# Altium schematic sheet design_16.SchDoc: design
size 414 x 279 mm; Date: 1/25/2021 11:39:22 PM; SheetNumber: 17; Origin: Eagle; GateName_1: G$1; SymbolName_1: A3-L-GUMSTIX; LibraryName: qualified_1; DeviceSetName: A3-L-GUMSTIX; A: A; B: B; C: C; D: D; E: E; F: F; G: G; H: H; 1: 1; 2: 2; 3: 3; 4: 4; 5: 5; Sheet: Sheet:; C:/Gumstix/gumstix-logo-16.bmp: C:/Gumstix/gumstix-logo-16.bmp; Board: Board:
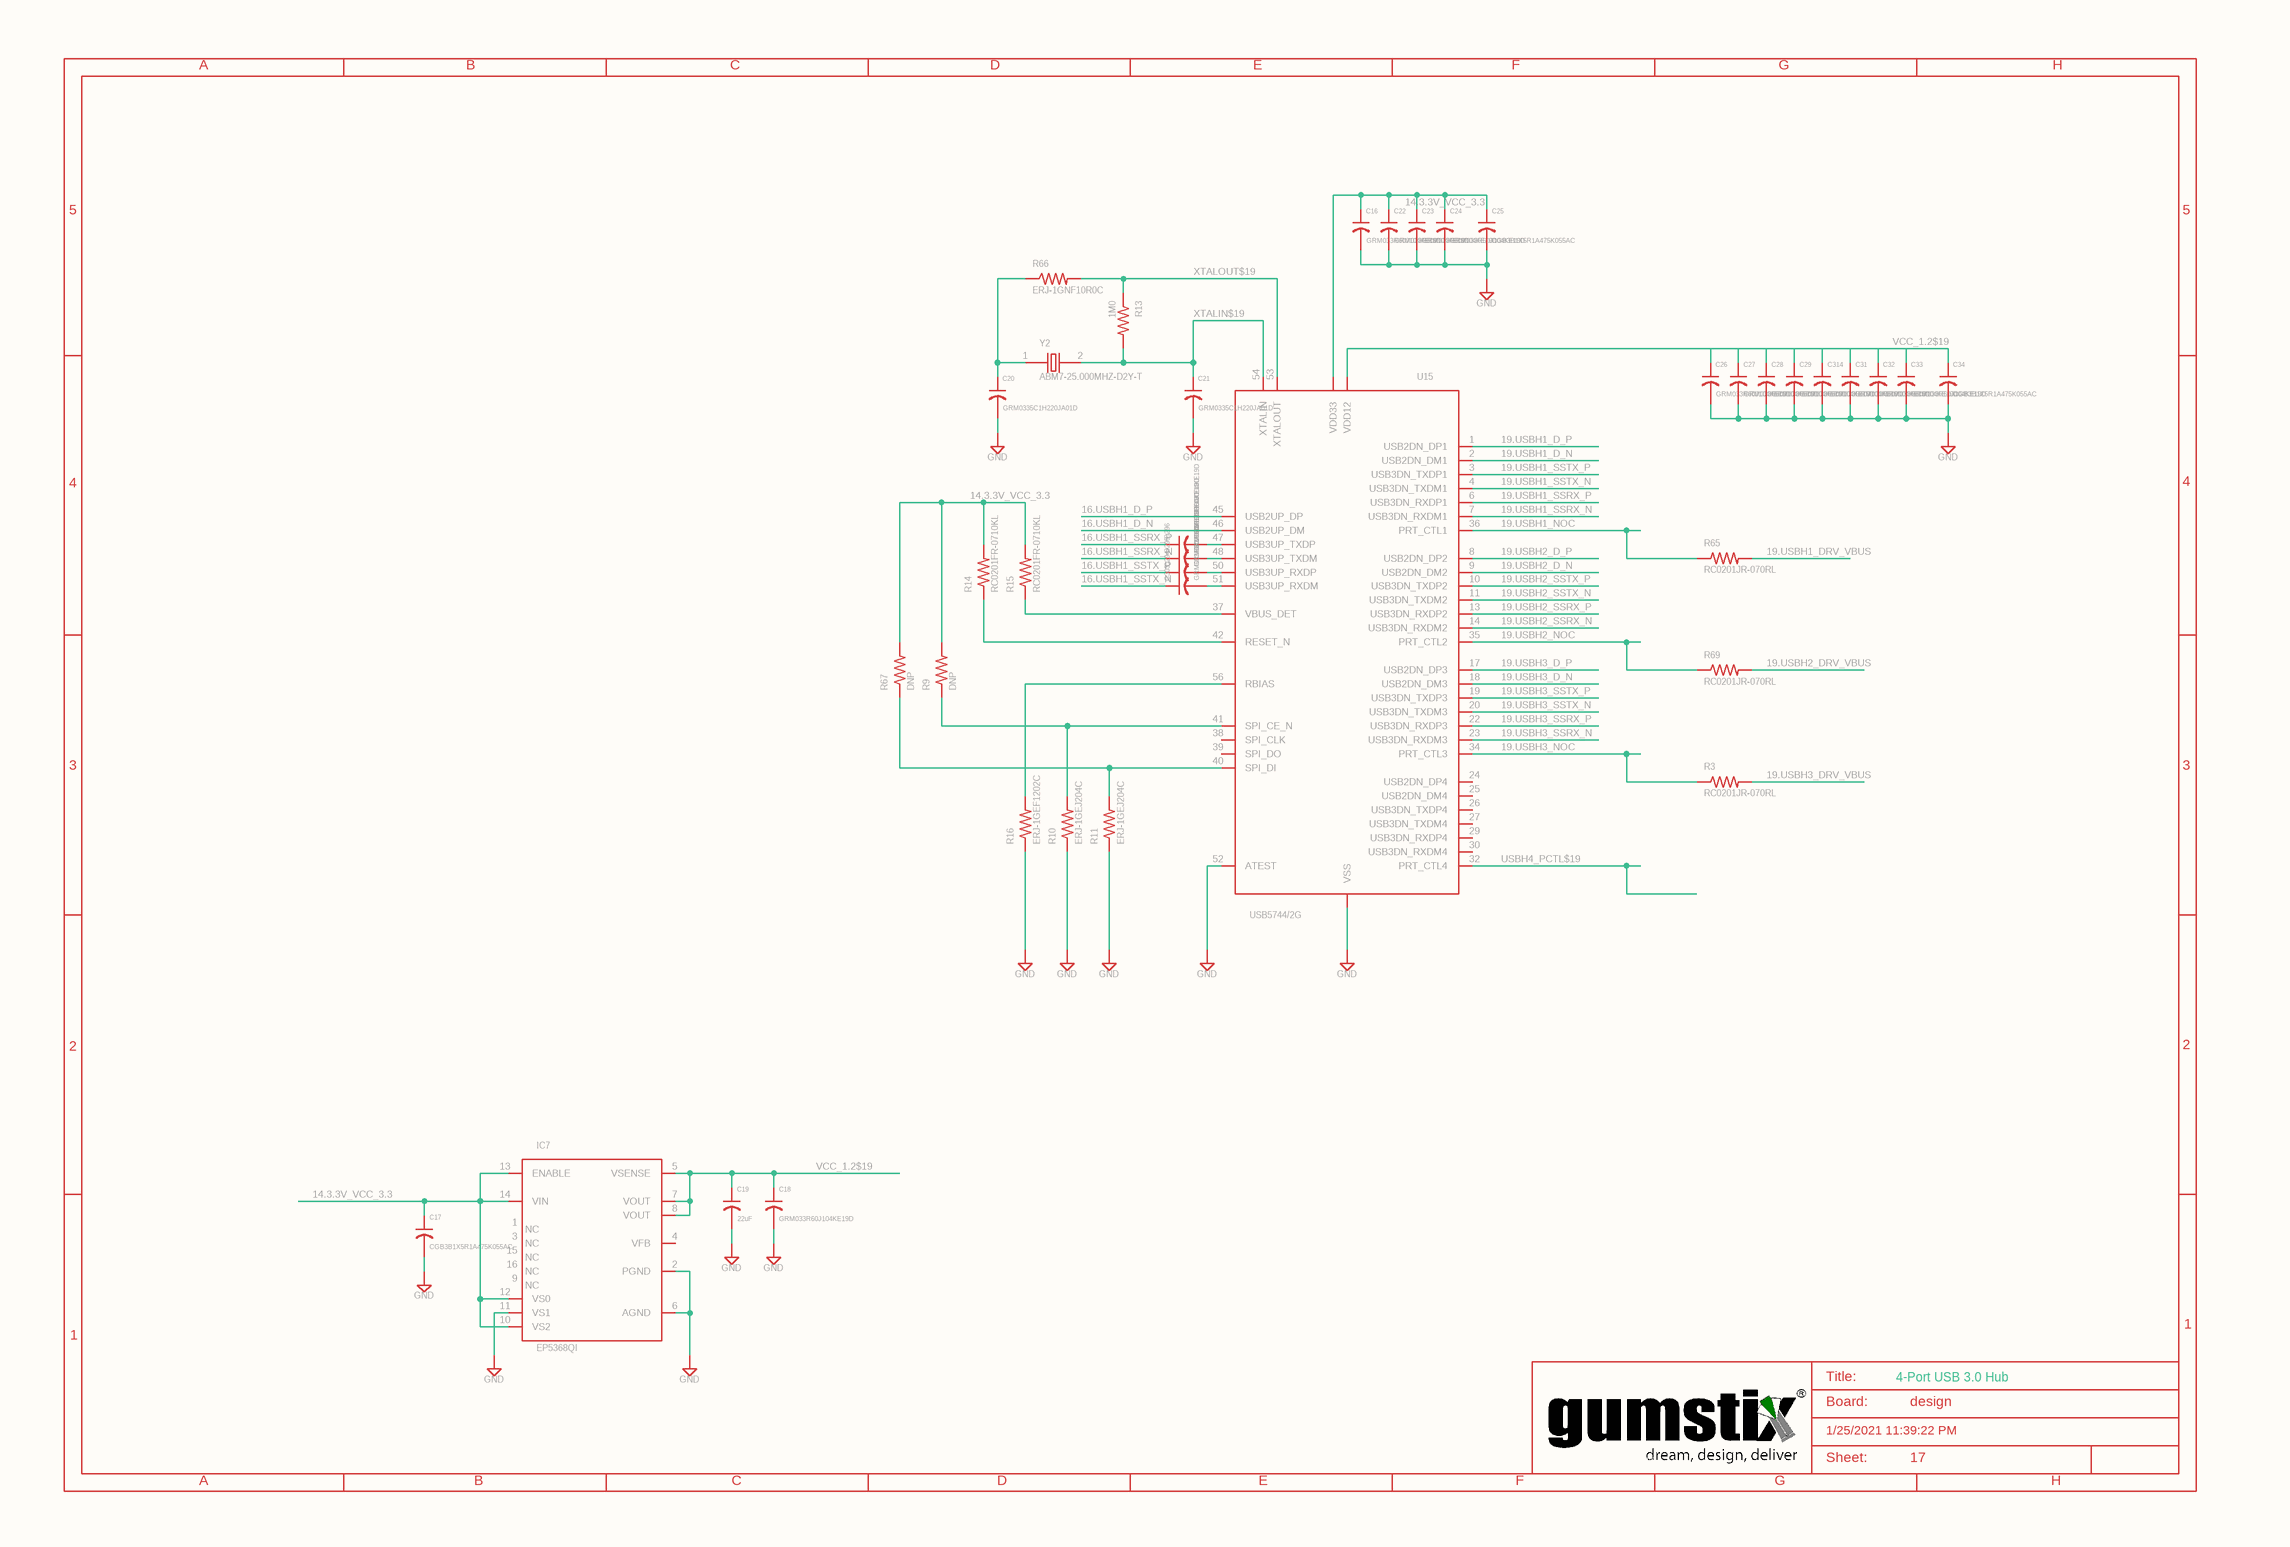
[diagram p0: design_16.SchDoc]

## Parts
C16  GRM033R60J104KE19D  [0201]
C17  CGB3B1X5R1A475K055AC  [0603]
C18  GRM033R60J104KE19D  [0201]
C19  22uF  [0805]
C20  GRM0335C1H220JA01D  [0201]
C21  GRM0335C1H220JA01D  [0201]
C22  GRM033R60J104KE19D  [0201]
C23  GRM033R60J104KE19D  [0201]
C24  GRM033R60J104KE19D  [0201]
C25  CGB3B1X5R1A475K055AC  [0603]
C26  GRM033R60J104KE19D  [0201]
C27  GRM033R60J104KE19D  [0201]
C28  GRM033R60J104KE19D  [0201]
C29  GRM033R60J104KE19D  [0201]
C31  GRM033R60J104KE19D  [0201]
C32  GRM033R60J104KE19D  [0201]
C33  GRM033R60J104KE19D  [0201]
C34  CGB3B1X5R1A475K055AC  [0603]
C294  GRM033R60J104KE19D  [0201]
C295  GRM033R60J104KE19D  [0201]
C296  GRM033R60J104KE19D  [0201]
C303  GRM033R60J104KE19D  [0201]
C314  GRM033R60J104KE19D  [0201]
IC7  EP5368QI  [EP-3X3MMQFN16]
R3  RC0201JR-070RL  [0201]
R9  DNP  [0201]
R10  ERJ-1GEJ204C  [0201]
R11  ERJ-1GEJ204C  [0201]
R13  1M0  [0201]
R14  RC0201FR-0710KL  [0201]
R15  RC0201FR-0710KL  [0201]
R16  ERJ-1GEF1202C  [0201]
R65  RC0201JR-070RL  [0201]
R66  ERJ-1GNF10R0C  [0201]
R67  DNP  [0201]
R69  RC0201JR-070RL  [0201]
SUPPLY15  GND
SUPPLY16  GND
SUPPLY17  GND
SUPPLY18  GND
SUPPLY19  GND
SUPPLY20  GND
SUPPLY21  GND
SUPPLY22  GND
SUPPLY23  GND
SUPPLY187  GND
U15  USB5744/2G  [VQFN56]
V1  GND
V2  GND
V3  GND
V5  GND
Y2  ABM7-25.000MHZ-D2Y-T  [CS10]

## Nets
14.3.3V_VCC_3.3: C16.1 C17.1 C22.1 C23.1 C24.1 C25.1 IC7.10(VS2) IC7.12(VS0) IC7.13(ENABLE) IC7.14(VIN) R9.2 R14.2 R15.2 R67.2 U15.16_31_44_55(VDD33)
16.USBH1_D_N: U15.46(USB2UP_DM)
16.USBH1_D_P: U15.45(USB2UP_DP)
16.USBH1_SSRX_N: C295.1
16.USBH1_SSRX_P: C296.1
16.USBH1_SSTX_N: C303.1
16.USBH1_SSTX_P: C294.1
19.USBH1_D_N: U15.2(USB2DN_DM1)
19.USBH1_D_P: U15.1(USB2DN_DP1)
19.USBH1_DRV_VBUS: R65.2
19.USBH1_NOC: R65.1 U15.36(PRT_CTL1)
19.USBH1_SSRX_N: U15.7(USB3DN_RXDM1)
19.USBH1_SSRX_P: U15.6(USB3DN_RXDP1)
19.USBH1_SSTX_N: U15.4(USB3DN_TXDM1)
19.USBH1_SSTX_P: U15.3(USB3DN_TXDP1)
19.USBH2_D_N: U15.9(USB2DN_DM2)
19.USBH2_D_P: U15.8(USB2DN_DP2)
19.USBH2_DRV_VBUS: R69.2
19.USBH2_NOC: R69.1 U15.35(PRT_CTL2)
19.USBH2_SSRX_N: U15.14(USB3DN_RXDM2)
19.USBH2_SSRX_P: U15.13(USB3DN_RXDP2)
19.USBH2_SSTX_N: U15.11(USB3DN_TXDM2)
19.USBH2_SSTX_P: U15.10(USB3DN_TXDP2)
19.USBH3_D_N: U15.18(USB2DN_DM3)
19.USBH3_D_P: U15.17(USB2DN_DP3)
19.USBH3_DRV_VBUS: R3.2
19.USBH3_NOC: R3.1 U15.34(PRT_CTL3)
19.USBH3_SSRX_N: U15.23(USB3DN_RXDM3)
19.USBH3_SSRX_P: U15.22(USB3DN_RXDP3)
19.USBH3_SSTX_N: U15.20(USB3DN_TXDM3)
19.USBH3_SSTX_P: U15.19(USB3DN_TXDP3)
USBH4_PCTL$19: U15.32(PRT_CTL4)
VCC_1.2$19: C18.1 C19.1 C26.1 C27.1 C28.1 C29.1 C31.1 C32.1 C33.1 C34.1 C314.1 IC7.5(VSENSE) IC7.7(VOUT) IC7.8(VOUT) U15.5_12_15_21_28_33_43_49(VDD12)
XTALIN$19: C21.1 R13.2 U15.54(XTALIN) Y2.2
XTALOUT$19: R13.1 R66.2 U15.53(XTALOUT)
NetC16_2: C16.2 C22.2 C23.2 C24.2 C25.2 V1.?1(GND)
NetC17_2: C17.2 SUPPLY15.?1(GND)
NetC18_2: C18.2 SUPPLY19.?1(GND)
NetC19_2: C19.2 SUPPLY18.?1(GND)
NetC20_1: C20.1 R66.1 Y2.1
NetC20_2: C20.2 V3.?1(GND)
NetC21_2: C21.2 V5.?1(GND)
NetC26_2: C26.2 C27.2 C28.2 C29.2 C31.2 C32.2 C33.2 C34.2 C314.2 V2.?1(GND)
NetC294_2: C294.2 U15.50(USB3UP_RXDP)
NetC295_2: C295.2 U15.48(USB3UP_TXDM)
NetC296_2: C296.2 U15.47(USB3UP_TXDP)
NetC303_2: C303.2 U15.51(USB3UP_RXDM)
NetIC7_2: IC7.2(PGND) IC7.6(AGND) SUPPLY17.?1(GND)
NetIC7_11: IC7.11(VS1) SUPPLY16.?1(GND)
NetR9_1: R9.1 R10.2 U15.41(SPI_CE_N)
NetR10_1: R10.1 SUPPLY22.?1(GND)
NetR11_1: R11.1 SUPPLY21.?1(GND)
NetR11_2: R11.2 R67.1 U15.40(SPI_DI)
NetR14_1: R14.1 U15.42(RESET_N)
NetR15_1: R15.1 U15.37(VBUS_DET)
NetR16_1: R16.1 SUPPLY187.?1(GND)
NetR16_2: R16.2 U15.56(RBIAS)
NetSUPPLY20_?1: SUPPLY20.?1(GND) U15.P$1_P$2_P$3_P$4_P$5_P$6_P$7_P$8_P$9_P$10_P$11_P$12_P$13_P$14_P$15_P$16_P$17_P$18_P$19_P$20_P$21_P$22_P$23_P$24_P$25(VSS)
NetSUPPLY23_?1: SUPPLY23.?1(GND) U15.52(ATEST)

Not connected (* = marked no-connect by the designer): IC7 1(NC) 3(NC) 4(VFB) 9(NC) 15(NC) 16(NC); U15 24(USB2DN_DP4) 25(USB2DN_DM4) 26(USB3DN_TXDP4) 27(USB3DN_TXDM4) 29(USB3DN_RXDP4) 30(USB3DN_RXDM4) 38(SPI_CLK) 39(SPI_DO)

## Notes on the sheet
- A
- B
- C
- D
- E
- F
- G
- H
- 5
- 4
- 3
- 2
- 1
- Title:
- Board:
- 4-Port USB 3.0 Hub
- design
- C:/Gumstix/gumstix-logo-16.bmp
- 1/25/2021 11:39:22 PM
- Sheet:
- 17

## Library data of the parts
C16 C18 C22-C24 C26-C29 C31-C33 C294-C296 C303 C314 = GRM033R60J104KE19D: GateName_1: G$1; SymbolName_1: C-US; LibraryName: qualified_1@eagle_src_repo_b39d46a5feff4f7ade7f2a4f70c4d4847a03ea32; DeviceSetName: GRM033R60J104KE19D; HEIGHT: 0.25
C17 C25 C34 = CGB3B1X5R1A475K055AC: GateName_1: G$1; SymbolName_1: C-US; LibraryName: qualified_1@eagle_src_repo_b39d46a5feff4f7ade7f2a4f70c4d4847a03ea32; DeviceSetName: CGB3B1X5R1A475K055AC; HEIGHT: 0.5
  C17: DM: DM; DR: DR; DX: DX; DY: DY; SHEETNO: SHEETNO
C19 = C0805: GateName_1: G$1; SymbolName_1: C-US; DeviceSetName: C; DeviceName: 0805; LibraryName: qualified_1@eagle_src_repo_b39d46a5feff4f7ade7f2a4f70c4d4847a03ea32; HEIGHT: 0.51
C20 C21 = GRM0335C1H220JA01D: GateName_1: G$1; SymbolName_1: C-US; LibraryName: qualified_1@eagle_src_repo_b39d46a5feff4f7ade7f2a4f70c4d4847a03ea32; DeviceSetName: GRM0335C1H220JA01D; DM: DM; DR: DR; DX: DX; DY: DY; HEIGHT: 0.25; SHEETNO: SHEETNO
IC7 = EP5368QI: GateName_1: G$1; SymbolName_1: EP5368; LibraryName: qualified_1; DeviceSetName: EP5368QI; HEIGHT: 1.1
R3 R65 R69 = RC0201JR-070RL: GateName_1: G$1; SymbolName_1: R-US; LibraryName: qualified_1; DeviceSetName: RC0201JR-070RL; DM: DM; DR: DR; DX: DX; DY: DY; HEIGHT: 0.25; SHEETNO: SHEETNO
R9 R13 R67 = R0201: GateName_1: G$1; SymbolName_1: R-US; DeviceSetName: R; DeviceName: 0201; LibraryName: qualified_1; HEIGHT: 0.25
  R13: DM: DM; DR: DR; DX: DX; DY: DY; SHEETNO: SHEETNO
R10 R11 = ERJ-1GEJ204C: GateName_1: G$1; SymbolName_1: R-US; LibraryName: qualified_1; DeviceSetName: ERJ-1GEJ204C; HEIGHT: 0.25
R14 R15 = RC0201FR-0710KL: GateName_1: G$1; SymbolName_1: R-US; LibraryName: qualified_1; DeviceSetName: RC0201FR-0710KL; DM: DM; DR: DR; DX: DX; DY: DY; HEIGHT: 0.25; SHEETNO: SHEETNO
R16 = ERJ-1GEF1202C: GateName_1: G$1; SymbolName_1: R-US; LibraryName: qualified_1; DeviceSetName: ERJ-1GEF1202C; HEIGHT: 0.25
R66 = ERJ-1GNF10R0C: GateName_1: G$1; SymbolName_1: R-US; LibraryName: qualified_1; DeviceSetName: ERJ-1GNF10R0C; DM: DM; DR: DR; DX: DX; DY: DY; HEIGHT: 0.25; SHEETNO: SHEETNO
SUPPLY15-SUPPLY23 SUPPLY187 V1-V3 V5 = GND: SUPPLY SYMBOL; SymbolName_1: GND-2; GateName_1: GND; LibraryName: qualified_1; DeviceSetName: GND
  V1-V3 V5: SHEETNO: SHEETNO
U15 = USB5744/2G: USB5744    4-Port SS/HS USB Controller Hub    http://ww1.microchip.com/downloads/en/DeviceDoc/00001855D.pdf; GateName_1: U1; SymbolName_1: USB5744; LibraryName: qualified_1; DeviceSetName: USB5744/2G
Y2 = ABM7-25.000MHZ-D2Y-T: GateName_1: G$1; SymbolName_1: Q1; LibraryName: qualified_1@eagle_src_repo_b39d46a5feff4f7ade7f2a4f70c4d4847a03ea32; DeviceSetName: ABM7-25.000MHZ-D2Y-T; 1: 1; 2: 2; DM: DM; DR: DR; DX: DX; DY: DY; HEIGHT: 1.5; SHEETNO: SHEETNO